# EAGLE schematic amp (EAGLE 6.4)
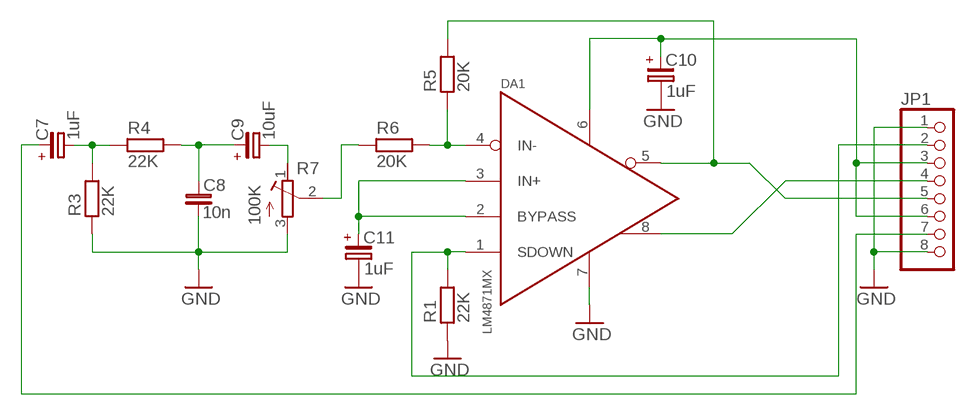
[diagram p0: schematic, sheet 1]

## Parts
C7  1uF  CP_SMCA  [SMC_A]
C8  10n  C_0805  [C0805]
C9  10uF  CP_SMCA  [SMC_A]
C10  1uF  CP_SMCB  [SMC_B]
C11  1uF  CP_SMCA  [SMC_A]
DA1  LM4871MX  [SO08]
JP1  PINHD-1X8_2.54-90°  [1X08/90]
R1  22K  R_0805  [R0805]
R3  22K  R_0805  [R0805]
R4  22K  R_0805  [R0805]
R5  20K  R_0805  [R0805]
R6  20K  R_0805  [R0805]
R7  100K  RTRIM  [RTRIM-3362P]

## Nets
GND: C8.2 C10.- C11.- DA1.7(GND) JP1.1 JP1.8 R1.1 R3.1 R7.3(E)
N$1: DA1.1(SDOWN) JP1.2 R1.2
N$3: C10.+ DA1.6(VCC) JP1.3 JP1.6
N$4: DA1.8(OUT+) JP1.4
N$5: C7.+ JP1.7
N$7: C7.- R3.2 R4.1
N$8: C8.1 C9.+ R4.2
N$10: DA1.4(IN-) R5.1 R6.2
N$12: C9.- R7.1(A)
N$13: R6.1 R7.2(S)
N$14: C11.+ DA1.2(BYPASS) DA1.3(IN+)
N$15: DA1.5(OUT-) JP1.5 R5.2

## Library data of the parts
C7 C9-C11 = rc-master-smd:CP_: POLARIZED CAP
C8 = rc-master-smd:C_: NON-POLARIZED CAP
DA1 = power_amp:LM4871: 3W Audio Power Amplifier with Shutdown Mode
JP1 = pinhead-fixdrills:PINHD-1X8: PIN HEADER
R1 R3-R6 = rc-master-smd:R_: RESISTOR
R7 = lcd-char:RTRIM